# EAGLE board octanis_v0.6 (EAGLE 7.2.0)
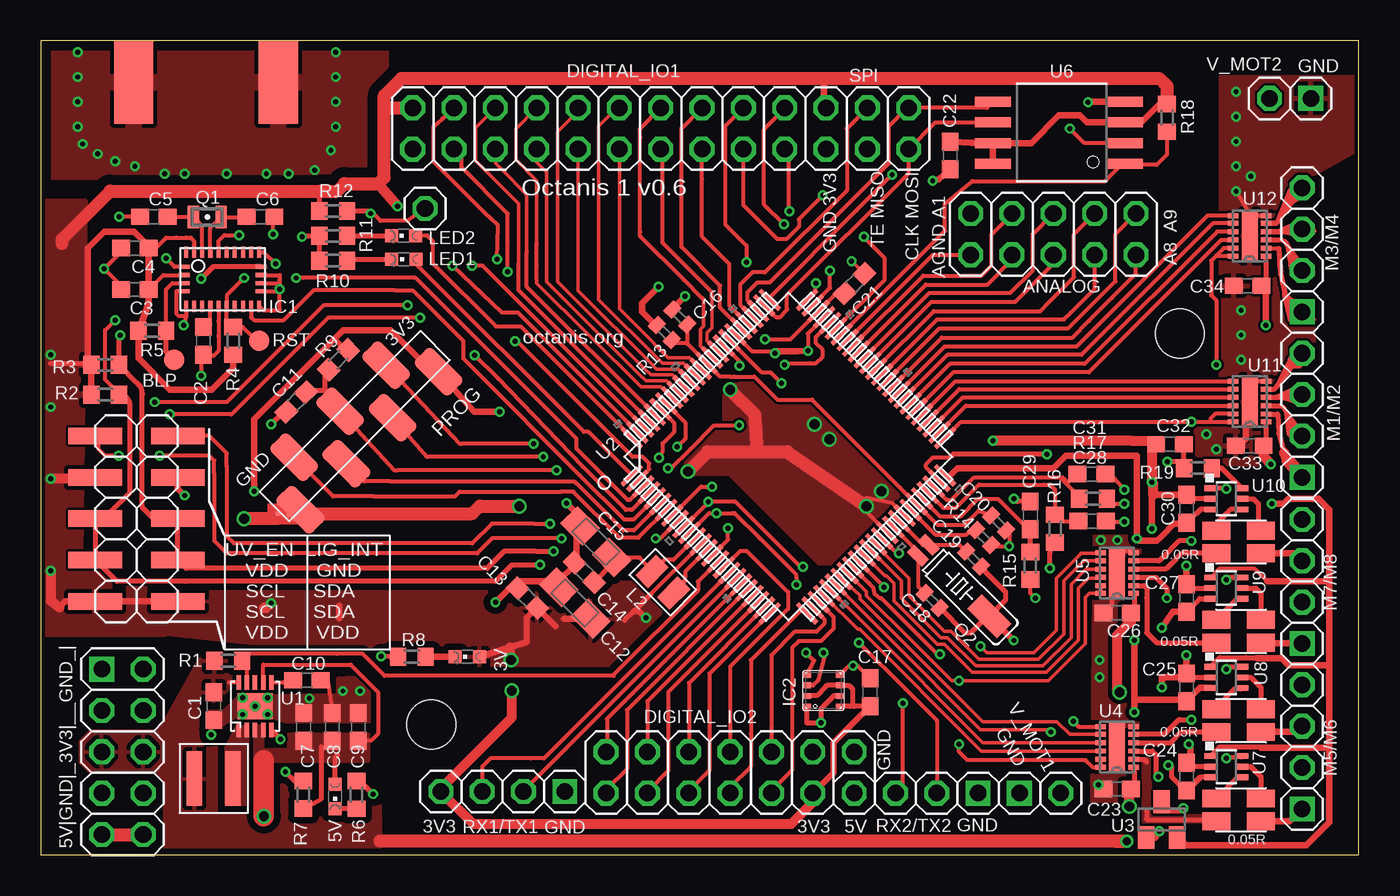
[diagram p2: board, top side]
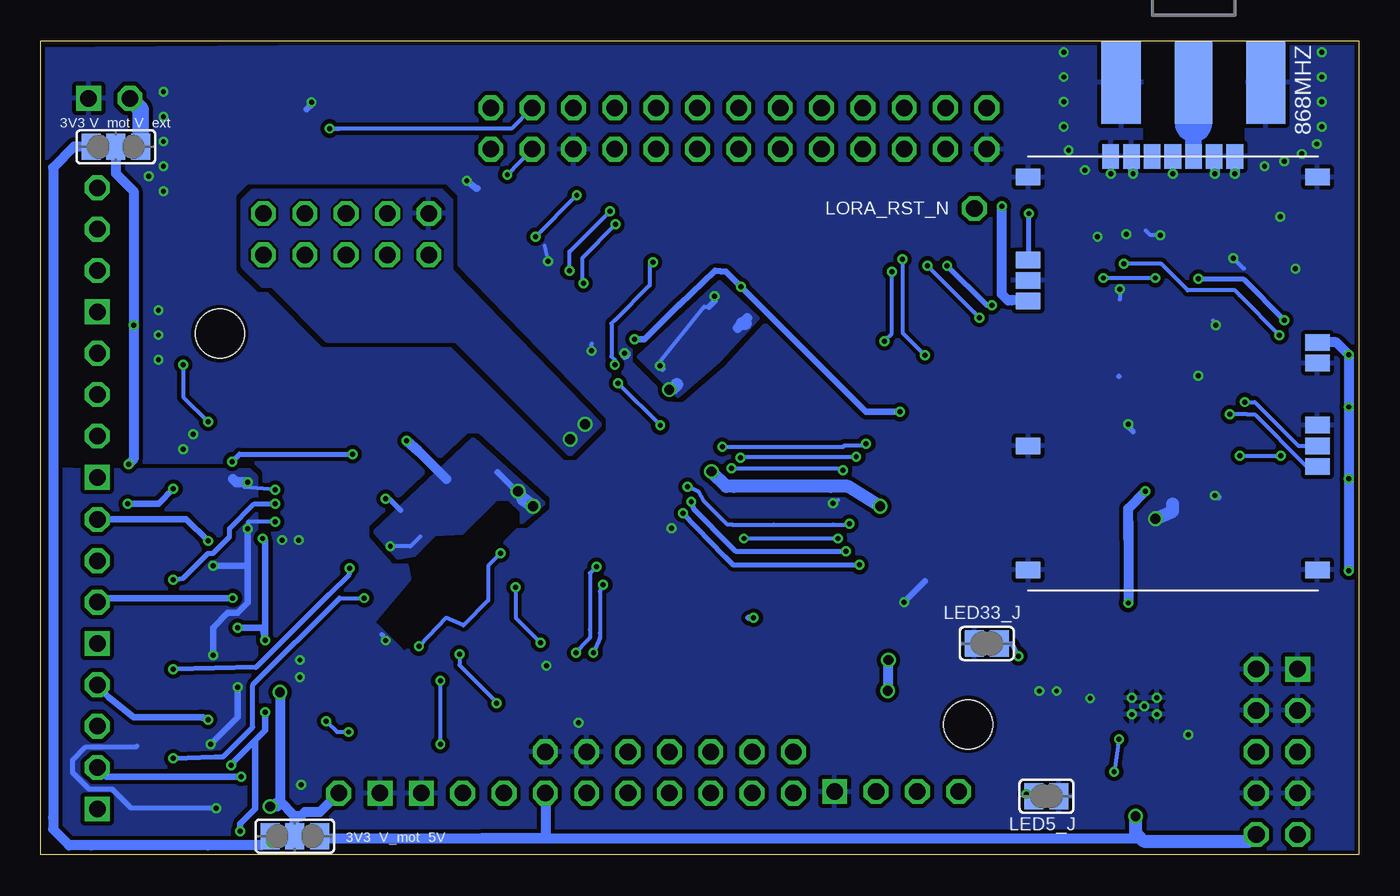
[diagram p3: board, bottom side, seen from below]

Size 81 x 50 mm. Coordinates in mm from the lower left corner, seen from the top.
Outline: 0,0 81,0 81,50 0,50 0,0
Copper layers (1*16): Top 0.035mm / dielectric 1.5mm / Bottom 0.035mm
Design rules "SeeedStudio_2layer_DRU_no_angle_20140221 *": minimum track width 8mil, minimum drill 12mil, track to track 6mil, track to pad 8mil, pad to pad 6mil, via to via 8mil, smd to smd 0mil, copper to edge 10mil, drill to drill 10mil, minimum pad ring 6mil, minimum via ring 6mil, stop-mask expansion 2mil, vias tented up to drill 100mil, thermal gap 10mil
Net classes: 0 default: width 0.203 mm; 1 power: width 0.203 mm, drill 0.305 mm, clearance 0.152 mm; 2 VIN: width 0.203 mm, drill 0.305 mm, clearance 0.152 mm; 3 fine: width 0.406 mm, drill 0.61 mm, clearance 0.152 mm
Holes 3 mm at 70,32 24,8

## Footprints (pad centres in the part's own frame; a part is rotated, then mirrored left to right if it is on the bottom)
CHIPLED_0603 = smd 0.8 x 0.8: A 0,-0.75; C 0,0.75
SMA_EDGELAUNCH = smd 5.08 x 2.413: GND@1 2.54,-4.445; GND@2 2.54,4.445 | smd 5.08 x 2.413 bottom: GND@3 2.54,4.445; GND@4 2.54,-4.445 | smd 5.08 x 2.286: P 2.54,0
2X05 = drill 1.016 octagon: 1 -5.08,-1.27; 2 -5.08,1.27; 3 -2.54,-1.27; 4 -2.54,1.27; 5 0,-1.27; 6 0,1.27; 7 2.54,-1.27; 8 2.54,1.27; 9 5.08,-1.27; 10 5.08,1.27
B1,27 = smd 1.27 x 1.27: TP 0,0
C0603 = smd 1.1 x 1: 1 -0.85,0; 2 0.85,0
A/3216-18R = smd 1.95 x 1.5: + 1.375,0; - -1.375,0
C0402 = smd 0.7 x 0.9: 1 -0.65,0; 2 0.65,0
2X11 = drill 1.016 octagon: 1 -12.7,-1.27; 2 -12.7,1.27; 3 -10.16,-1.27; 4 -10.16,1.27; 5 -7.62,-1.27; 6 -7.62,1.27; 7 -5.08,-1.27; 8 -5.08,1.27; 9 -2.54,-1.27; 10 -2.54,1.27; 11 0,-1.27; 12 0,1.27; 13 2.54,-1.27; 14 2.54,1.27; 15 5.08,-1.27; 16 5.08,1.27; 17 7.62,-1.27; 18 7.62,1.27; 19 10.16,-1.27; 20 10.16,1.27; 21 12.7,-1.27; 22 12.7,1.27
BNO055 = smd 0.675 x 0.25: 1 1.663,2.25; 6 -1.665,2.25; 7 -1.665,1.75; 8 -1.665,1.25; 9 -1.665,0.75; 10 -1.665,0.25; 11 -1.665,-0.25; 12 -1.665,-0.75; 13 -1.665,-1.25; 14 -1.665,-1.75; 15 -1.665,-2.25; 20 1.663,-2.25; 21 1.663,-1.75; 22 1.663,-1.25; 23 1.663,-0.75; 24 1.663,-0.25; 25 1.663,0.25; 26 1.663,0.75; 27 1.663,1.25; 28 1.663,1.75 | smd 0.25 x 0.675: 2 0.75,2.362; 3 0.25,2.362; 4 -0.25,2.362; 5 -0.75,2.362; 16 -0.75,-2.362; 17 -0.25,-2.362; 18 0.25,-2.362; 19 0.75,-2.362
BME280 = smd 0.35 x 0.5: 1 0.975,-1.025; 2 0.325,-1.025; 3 -0.325,-1.025; 4 -0.975,-1.025; 5 -0.975,1.025; 6 -0.325,1.025; 7 0.325,1.025; 8 0.975,1.025
2X05' = drill 1.016 square: 1 -5.08,-1.27 | drill 1.016 octagon: 2 -5.08,1.27; 3 -2.54,-1.27; 4 -2.54,1.27; 5 0,-1.27; 6 0,1.27; 7 2.54,-1.27; 8 2.54,1.27; 9 5.08,-1.27; 10 5.08,1.27
2X05SMD = smd 1.016 x 3.302: 1 -1.27,-3.81; 2 -1.27,1.27; 3 1.27,-3.81; 4 1.27,1.27; 5 3.81,-3.81; 6 3.81,1.27; 7 6.35,-3.81; 8 6.35,1.27; 9 8.89,-3.81; 10 8.89,1.27
2X02 = drill 1.016 octagon: 1 -1.27,-1.27; 2 -1.27,1.27; 3 1.27,-1.27; 4 1.27,1.27
XFL4020 = smd 0.965 x 3.353: P$1 -1.181,0; P$2 1.181,0
0806 = smd 1.1 x 1.8: 1 -0.94,0; 2 0.94,0
SJ = smd 1.168 x 1.6: 1 -0.762,0; 2 0.762,0
1X01 = drill 1.016 octagon: 1 0,0
1X04-S = drill 1.016 square: 1 -3.81,0 | drill 1.016 octagon: 2 -1.27,0; 3 1.27,0; 4 3.81,0
1X7SMD = smd 3.048 x 1.524: 1 -1.27,6; 2 1.27,4; 3 -1.27,2; 4 1.27,0; 5 -1.27,-2; 6 1.27,-4; 7 -1.27,-6
FC-12M = smd 0.7 x 1.4: 1 -0.85,0; 2 0.85,0
MS3V-T1R = smd 0.635 x 1.27: P1 -0.47,-4.43; P2 0.47,-4.43 | smd 1.27 x 2.54: P3 0,1.3
R0603 = smd 1 x 1.1: 1 -0.85,0; 2 0.85,0
R0402 = smd 0.7 x 0.9: 1 -0.65,0; 2 0.65,0
4PADS_RESISTOR = smd 1.727 x 1.1: I1 0,0; I2 2.751,0; V1 0,1.4; V2 2.751,1.4
S-PVSON-N10 = smd 0.28 x 0.825: 1 -1,-1.462; 2 -0.5,-1.462; 3 0,-1.462; 4 0.5,-1.462; 5 1,-1.462; 6 1,1.462; 7 0.5,1.462; 8 0,1.462; 9 -0.5,1.462; 10 -1,1.462 | smd 2.15 x 1.6: EXPAD 0,0 | drill 0.3 pad 0.605: GND1 -0.762,0.508 | drill 0.3 pad 0.61: GND2 -0.762,-0.508; GND3 0,0; GND4 0.762,-0.508 | drill 0.305 pad 0.605: GND5 0.762,0.508
PZ100 = smd 1.676 x 0.279: 1 -7.62,5.994; 2 -7.62,5.512; 3 -7.62,5.004; 4 -7.62,4.496; 5 -7.62,3.988; 6 -7.62,3.505; 7 -7.62,2.997; 8 -7.62,2.489; 9 -7.62,2.007; 10 -7.62,1.499; 11 -7.62,0.991; 12 -7.62,0.508; 13 -7.62,0; 14 -7.62,-0.508; 15 -7.62,-0.991; 16 -7.62,-1.499; 17 -7.62,-2.007; 18 -7.62,-2.489; 19 -7.62,-2.997; 20 -7.62,-3.505; 21 -7.62,-3.988; 22 -7.62,-4.496; 23 -7.62,-5.004; 24 -7.62,-5.512; 25 -7.62,-5.994; 51 7.62,-5.994; 52 7.62,-5.512; 53 7.62,-5.004; 54 7.62,-4.496; 55 7.62,-3.988; 56 7.62,-3.505; 57 7.62,-2.997; 58 7.62,-2.489; 59 7.62,-2.007; 60 7.62,-1.499; 61 7.62,-0.991; 62 7.62,-0.508; 63 7.62,0; 64 7.62,0.508; 65 7.62,0.991; 66 7.62,1.499; 67 7.62,2.007; 68 7.62,2.489; 69 7.62,2.997; 70 7.62,3.505; 71 7.62,3.988; 72 7.62,4.496; 73 7.62,5.004; 74 7.62,5.512; 75 7.62,5.994 | smd 0.279 x 1.676: 26 -5.994,-7.62; 27 -5.512,-7.62; 28 -5.004,-7.62; 29 -4.496,-7.62; 30 -3.988,-7.62; 31 -3.505,-7.62; 32 -2.997,-7.62; 33 -2.489,-7.62; 34 -2.007,-7.62; 35 -1.499,-7.62; 36 -0.991,-7.62; 37 -0.508,-7.62; 38 0,-7.62; 39 0.508,-7.62; 40 0.991,-7.62; 41 1.499,-7.62; 42 2.007,-7.62; 43 2.489,-7.62; 44 2.997,-7.62; 45 3.505,-7.62; 46 3.988,-7.62; 47 4.496,-7.62; 48 5.004,-7.62; 49 5.512,-7.62; 50 5.994,-7.62; 76 5.994,7.62; 77 5.512,7.62; 78 5.004,7.62; 79 4.496,7.62; 80 3.988,7.62; 81 3.505,7.62; 82 2.997,7.62; 83 2.489,7.62; 84 2.007,7.62; 85 1.499,7.62; 86 0.991,7.62; 87 0.508,7.62; 88 0,7.62; 89 -0.508,7.62; 90 -0.991,7.62; 91 -1.499,7.62; 92 -2.007,7.62; 93 -2.489,7.62; 94 -2.997,7.62; 95 -3.505,7.62; 96 -3.988,7.62; 97 -4.496,7.62; 98 -5.004,7.62; 99 -5.512,7.62; 100 -5.994,7.62
MAX6001 = smd 1 x 1.4: 1 -0.95,-1.1; 2 0.95,-1.1; 3 0,1.1
SON50P200X300X80-13N = smd 0.66 x 0.305: 1 -1.016,1.245; 2 -1.016,0.762; 3 -1.016,0.254; 4 -1.016,-0.254; 5 -1.016,-0.762; 6 -1.016,-1.245; 7 1.016,-1.245; 8 1.016,-0.762; 9 1.016,-0.254; 10 1.016,0.254; 11 1.016,0.762; 12 1.016,1.245 | smd 0.991 x 3.099: 13 0,0
SOIC_8-LEAD = smd 0.61 x 2.21: CE -1.905,-2.934; RST/HOLD -0.635,5.156; SCK 0.635,5.156; SI 1.905,5.156; SO -0.635,-2.934; VDD -1.905,5.156; VSS 1.905,-2.934; WP 0.635,-2.934
SC70-6 = smd 0.35 x 0.8: 1 -0.65,-0.95; 2 0,-0.95; 3 0.65,-0.95; 4 0.65,0.95; 5 0,0.95; 6 -0.65,0.95
RN2483 = smd 1.524 x 1.016: P$1 17.78,1.27; P$6 17.78,7.62; P$7 17.78,8.89; P$8 17.78,10.16; P$11 17.78,13.97; P$12 17.78,15.24; P$20 17.78,25.4; P$28 0,25.4; P$32 0,20.32; P$33 0,19.05; P$34 0,17.78; P$41 0,8.89; P$47 0,1.27 | smd 1.016 x 1.524: P$21 12.7,26.67; P$22 11.43,26.67; P$23 10.16,26.67; P$24 8.89,26.67; P$25 7.62,26.67; P$26 6.35,26.67; P$27 5.08,26.67
STAR = smd 0.152 x 0.305: AGND 0.635,-0.635; DGND 0.635,0.635 | smd 0.305 x 0.152: GND 0.635,0
1X02-S = drill 1.016 square: 1 -1.27,0 | drill 1.016 octagon: 2 1.27,0
SJ_2 = smd 1.168 x 1.6: 1 -1.524,0; 2 0,0; 3 1.524,0

## Placement (x,y rotation side)
3V  3V-ok  [CHIPLED_0603]  26.21,12.16 90 top
5V  5V-ok  [CHIPLED_0603]  18.08,3.57 180 top
868MHZ  [SMA_EDGELAUNCH]  10.16,49.98 270 bottom
ANALOG  [2X05]  62.23,38.12 0 top
BLP  PTR1B1,27  [B1,27]  8.21,30.4 180 top
C1  22uF  [C0603]  10.64,9.12 270 top
C2  100n  [C0603]  10.01,31.56 90 top
C3  100n  [C0603]  5.79,34.72 180 top
C4  120n  [C0603]  5.79,37.26 180 top
C5  12p  [C0603]  6.96,39.18 180 top
C6  12p  [C0603]  13.51,39.18 0 top
C7  22uF  [C0603]  16.17,7.85 90 top
C8  22uF  [C0603]  17.93,7.85 90 top
C9  3 x 22uF  [C0603]  19.53,7.85 90 top
C10  10nF  [C0603]  16.35,10.71 0 top
C11  1n  [C0603]  15.7,27.8 45 top
C12  10u  [A/3216-18R]  32.82,15.46 315 top
C13  100n  [C0603]  29.9,15.77 315 top
C14  100n  [C0603]  33.4,17.34 315 top
C15  10u  [A/3216-18R]  34.11,19.22 315 top
C16  100n  [C0402]  39.28,33.03 135 top
C17  100n  [C0603]  50.97,9.98 90 top
C18  12p  [C0402]  54.79,15.62 135 top
C19  12p  [C0402]  57.33,18.16 135 top
C20  100n  [C0402]  58.86,20.37 315 top
C21  100n  [C0603]  50.01,35.09 225 top
C22  100n  [C0603]  55.88,42.95 270 top
C23  470n  [C0603]  66.14,4.03 0 top
C24  10n  [C0603]  70.41,4.79 270 top
C25  10n  [C0603]  70.41,10.28 270 top
C26  470n  [C0603]  66.14,14.85 0 top
C27  10n  [C0603]  70.41,15.76 270 top
C28  470n  [C0603]  64.62,20.49 180 top
C29  470n  [C0603]  60.81,20.84 270 top
C30  10n  [C0603]  70.41,21.25 270 top
C31  470n  [C0603]  64.57,23.38 180 top
C32  470n  [C0603]  69.39,25.21 0 top
C33  470n  [C0603]  74.3,25.12 0 top
C34  470n  [C0603]  74.16,34.94 0 top
DIGITAL_IO1  [2X11]  35.56,44.61 180 top
DIGITAL_IO2  [2X05]  39.83,5.05 0 top
IC1  BNO055A  [BNO055]  11.18,35.36 90 top
IC2  BME280  [BME280]  48.1,10.08 270 top
JP1  [2X05']  5.03,6.32 270 top
JP2  [2X05SMD]  7.16,24.45 270 top
JP3  [2X02]  48.72,5.05 0 top
L1  1uH  [XFL4020]  10.64,4.67 0 top
L2  4.7uH  [0806]  38.23,16.73 315 top
LED1  LED1  [CHIPLED_0603]  22.33,36.57 90 top
LED2  LED0  [CHIPLED_0603]  22.3,38.02 90 top
LED5_J  [SJ]  19.19,3.59 180 bottom
LED33_J  [SJ]  22.86,12.97 0 bottom
LORA_RST_N  [1X01]  23.62,39.69 0 top
M1/M2  [1X04-S]  77.52,26.99 90 top
M3/M4  [1X04-S]  77.52,37.15 90 top
M5/M6  [1X04-S]  77.52,6.62 90 top
M7/M8  [1X04-S]  77.52,16.78 90 top
PROG  [1X7SMD]  19.3,26.33 135 top
Q1  32.768kHz  [FC-12M]  10.24,39.17 180 top
Q2  32.768kHz  [MS3V-T1R]  57.38,15.57 225 top
R1  1M  [R0603]  11.53,11.91 180 top
R2  4.7k  [R0603]  3.96,28.26 180 top
R3  4.7k  [R0603]  3.96,30.09 180 top
R4  100k  [R0603]  11.84,31.56 90 top
R5  100k  [R0603]  6.86,32.18 180 top
R6  1k  [R0603]  19.41,3.67 270 top
R7  1M  [R0603]  16.14,3.68 270 top
R8  1k  [R0603]  22.81,12.16 0 top
R9  47k  [R0603]  18.29,30.39 225 top
R10  1k  [R0603]  17.98,36.49 0 top
R11  1k  [R0603]  17.98,38.01 0 top
R12  100k  [R0603]  17.98,39.54 180 top
R13  0R  [R0402]  38.33,32.08 135 top
R14  91k 0.1% ±25 ppm/°C  [R0402]  57.94,19.48 315 top
R15  6.8k  [R0603]  60.81,17.75 270 top
R16  6.8k  [R0603]  62.33,20.03 270 top
R17  6.8k  [R0603]  64.67,21.86 0 top
R18  10k  [R0603]  69.21,45.26 90 top
R19  6.8k  [R0603]  71.12,23.74 0 top
RS1  0.05R  [4PADS_RESISTOR]  72.24,2.05 0 top
RS2  0.05R  [4PADS_RESISTOR]  72.24,7.53 0 top
RS3  0.05R  [4PADS_RESISTOR]  72.24,13.02 0 top
RS4  0.05R  [4PADS_RESISTOR]  72.24,18.51 0 top
RST  PTR1B1,27  [B1,27]  13.41,31.57 180 top
RX1/TX1  [1X04-S]  28.4,3.88 180 top
RX2/TX2  [1X04-S]  53.8,3.78 180 top
SPI  [2X02]  52.07,44.61 0 top
U1  TPS61232  [S-PVSON-N10]  13.18,9.12 0 top
U2  MSP432  [PZ100]  45.95,24.45 45 top
U3  MAX6001SOT-23  [MAX6001]  68.88,2.15 0 top
U4  DRV8836DSSR  [SON50P200X300X80-13N]  66.14,6.62 180 top
U5  DRV8836DSSR  [SON50P200X300X80-13N]  66.14,17.29 180 top
U6  SST25VF064C  [SOIC_8-LEAD]  63.68,44.35 90 top
U7  INA210  [SC70-6]  72.85,5.4 270 top
U8  INA210  [SC70-6]  72.85,10.89 270 top
U9  INA210  [SC70-6]  72.85,16.37 270 top
U10  INA210  [SC70-6]  72.85,21.86 270 top
U11  DRV8836DSSR  [SON50P200X300X80-13N]  74.29,27.83 180 top
U12  DRV8836DSSR  [SON50P200X300X80-13N]  74.29,38.02 180 top
U100  RN2483  [RN2483]  20.32,16.22 0 bottom
U$1  WEATHER_STRIP_DOCU  [WEATHER_STRIP_DOCU]  16.38,17.06 0 top
U$2  STARGND  [STAR]  15.21,21.55 270 top
V_MOT1  [1X02-S]  61.42,3.78 0 top
V_MOT2  [1X02-S]  76.78,46.46 180 top
VMOT_SEL  3V3 V_Motor 5V  [SJ_2]  76.38,43.48 0 bottom
VMOT_SEL100  3V3 V_Motor 5V  [SJ_2]  65.38,1.13 0 bottom

## Tracks (layer width: path | path; a pad name or v marks a point on that pad's centre or on a via)
3V3_MODULE2  (via drill 0.5)
  Top 0.254: U1.10 12.18,10.89 | U1.10 | U1.10 11.58,10.58
  Top 0.813: 65.99,0.83 v66.75,0.83 65.99,0.83 | 65.99,0.83 20.83,0.83
  Bottom 0.61: v66.75,0.83 VMOT_SEL100.1 67.46,0.57 70.71,0.57 77.88,0.57 79.25,0.57 80.24,1.56 80.24,2.28 80.24,42.2 78.94,43.5 78.33,43.5 78.31,43.48 VMOT_SEL.1
  pour Top (isolate 0.406, rank 3): 7.92,-0.09 20.88,-0.14 20.83,9.92 20.73,9.97 10.97,12.26 10.06,12.46 7.62,8.14 7.01,7.53 3.05,7.53 2.44,6.92 2.44,5.71 3.05,5.1 7.01,5.1 7.62,4.49 7.62,0.22
5VEN
  Top 0.254: U1.9 12.68,12.29 R1.1 12.76,12.34 18.16,12.34 19.78,12.34 21.13,10.99 35.2,10.99 35.2,11.04 40.39,16.22 40.39,16.77 U2.16
+3V3  (via drill 0.3, 0.6)
  Top 0.254: U2.13 37.52,16.02 | 47.76,33.38 U2.73 | v44.5,31.65 46.07,31.65 U2.73 | C21.2 49.08,34.66 U2.73 | 9.43,37.44 IC1.28 9.43,37.69 9.22,37.9 8.97,37.9 8.34,37.9 7.7,37.9 7.07,37.26 C4.1 | C3.1 7.53,35.61 IC1.3 | R4.1 12.21,30.34 | C17.1 50.94,9.1 | 17.13,40.85 17.22,40.93 17.22,40.76 | 17.07,30.62 16.99,30.62
  Top 0.305: IC2.2 47.09,9.77 47.69,9.77 48.23,10.32 48.32,10.4 IC2.6 49.66,10.4 49.89,10.18 49.89,9.21 49.99,9.1 | 37.52,16.02 37.45,15.95 36.46,14.96 35.88,14.39 | 11.73,30.61 R4.1 | 50.94,9.1 49.99,9.1 | 49.99,9.1 49.78,9.1 IC2.8 | R12.2 17.13,40.85 | R9.1 18.75,31 18.06,31.69 | 2.9,30.31 2.75,30.17 0.61,30.17
  Top 0.406: 18.34,14.53 18.34,15.29 | R13.2 37.77,32.53 36.96,33.35 36.96,33.88 v37.97,34.89 | U6.RST/HOLD 60.12,43.71 60.87,43.71 62.56,45.41 63.87,45.41 64.29,44.98 U6.WP 66.66,45.02 67.67,45.02 68.75,46.11 R18.2 | U6.RST/HOLD U6.VDD | C22.1 55.99,43.8 57.15,43.74 58.5,43.74 U6.RST/HOLD | DIGITAL_IO1.1 48.13,46 48.13,47.32 48.13,47.49 47.93,47.69 | C12.+ 32.17,14.49 | 31.64,14.03 C13.2 29.87,14.54 29.87,13.06 28.84,12.74 3V.A | v37.19,14.54 36.77,14.96 36.46,14.96 | 3.05,27.96 3.05,28.26 R2.2 R3.2 2.9,30.31 2.9,37.25 3.2,37.56 3.91,38.27 5.74,38.27 5.89,38.12 6.64,37.36 C4.1 C3.1 6.64,33.88 R5.2 6.01,30.48 7.92,28.57 10.52,28.57 11.53,29.58 11.84,29.89 R4.1 | v28.19,27.19 26.62,27.19 PROG.7 | 23.43,30.29 21.49,32.22 18.59,32.22 18.06,31.69 16.99,30.62 13.11,26.74 13.11,23.69 v13.11,22.32 | JP3.1 48.72,5.04 48.72,6.88 C17.1 | JP2.10 1.52,15.56 1.14,15.18
  Top 0.61: v14.17,15.46 13.87,15.15 13.72,15.15 | v0.61,17.44 0.61,15.61 1.14,15.18 | PROG.7 23.43,30.29 | 2.23,23.08 v0.61,23.08 | v21.95,39.84 20.73,41.22 | JP3.1 47.45,3.22 46.13,1.9 26.57,1.9 RX1/TX1.4 24.69,3.98 24.69,4.18 28.96,8.45 v28.96,10.07 | v28.91,11.95 28.84,12.02 28.84,12.74
  Top 0.813: 1.29,37.56 1.29,37.79 4.27,40.76 17.22,40.76 18.21,40.76 18.67,41.22 20.73,41.22 21.11,41.6 21.11,45.86 | 21.11,45.86 21.11,46.62 22.17,47.69 47.7,47.69 47.93,47.69 68.73,47.69 69.04,47.39 69.21,47.22 R18.2 | DIGITAL_IO1.21 22.85,45.86 21.11,45.86
  Bottom 0.305: U100.P$12 2.46,31.38 1.37,31.38
  Bottom 0.406: v44.5,31.65 43.89,31.65 41.77,33.78 41.73,33.78 39.55,35.86 38.89,35.81 v37.97,34.89 30.27,27.19 v28.19,27.19 | 37.49,14.54 v37.19,14.54 | v0.61,23.08 0.61,23.54
  Bottom 0.61: 14.17,20.49 14.17,19.42 | 14.17,19.42 v14.17,15.46 | v0.61,17.44 v0.61,23.08 0.61,23.54 v0.61,27.5 0.61,27.8 v0.61,30.7 1.37,31.46 U100.P$12 | 14.17,19.42 14.17,21.25 v13.11,22.32 | v21.95,39.84 21.95,37.41 21.95,34.43 21.57,34.05 21.34,34.05 20.37,34.05 U100.P$34 | v28.96,10.07 28.91,10.12 v28.91,11.95
  pour Top: 0.36,13.58 7.62,13.58 7.62,17.69 2.44,18.35 2.69,40.1 0.36,40.1
  pour Top (isolate 0.406, rank 2): 7.62,16.73 38.66,16.73 37.8,10.33 7.67,13.53
+5V  (via drill 0.6)
  Top 0.254: U1.7 13.68,11.67 19.05,11.67 20.73,9.99 20.73,7.43 20.29,7 C9.1
  Top 0.305: R7.2 17.25,3.44 17.25,6.64 | 5V.A 18.09,5.97 18.24,6.12
  Top 0.813: JP1.9 JP1.10
  Top 1.27: v13.72,2.35 13.72,5.81
  Bottom 0.61: 53.95,1 63.59,1 63.72,1 VMOT_SEL100.3 | 53.95,1 49.99,1 | 49.99,1 13.41,1 | 49.99,1 JP3.3 49.99,1 | 49.99,1 53.95,1 | 6.71,0.83 JP1.10
  Bottom 0.813: v13.72,2.35 13.72,1.31 13.41,1 13.24,0.83 6.71,0.83
  pour Top (no thermals): 20.16,7.37 15.24,7.37 15.24,6.42 13.65,6.42 13.65,7.85 13.18,7.85 13.18,5.78 20.16,5.78
A1
  Top 0.254: U2.68 54.82,36.85 ANALOG.1
A2
  Top 0.254: U2.67 54.23,35.58 57.15,35.58 57.81,35.58 58.42,36.19 58.42,38.06 59.69,39.34 ANALOG.4
A3
  Top 0.254: U2.66 54.39,35.02 58.17,35.02 59.69,36.54 ANALOG.3
A4
  Top 0.254: U2.65 54.6,34.51 59.59,34.51 60.96,35.88 60.96,38.12 ANALOG.6
A5
  Top 0.254: U2.64 54.73,33.95 59.89,33.95 60.76,34.81 62.23,36.29 ANALOG.5
A6
  Top 0.254: U2.63 54.89,33.39 61.42,33.39 62.03,34 63.5,35.47 63.5,38.12 ANALOG.8
A7
  Top 0.254: U2.62 55.1,32.88 62.89,32.88 63.3,33.29 64.77,34.76 ANALOG.7
A8
  Top 0.254: U2.61 55.22,32.33 63.14,32.33 64.62,33.8 66.04,35.22 66.04,38.12 ANALOG.10
A9
  Top 0.254: U2.60 55.38,31.77 63.4,31.77 64.41,32.78 65.84,34.2 67.31,35.68 ANALOG.9
A20  (via drill 0.3)
  Top 0.254: U2.49 54.56,23.64 54.41,23.79 54.41,23.99 54.81,24.4 54.91,24.4 55.88,24.4 55.93,24.45
  Top 0.305: 70.24,23.77 R19.1 70.24,23.77 | 70.24,23.77 69.86,24.15 v69.24,24.15 | 70.24,23.77 C32.2 | v61.82,24.6 56.08,24.6 55.93,24.45
  Bottom 0.305: v69.24,24.15 68.78,24.6 v61.82,24.6
A20UNF
  Top 0.305: U10.6 72.57,23.74 R19.2
A21
  Top 0.254: U2.48 55.67,21.81 56.08,21.81 56.08,21.91 57.35,23.18 62.64,23.18 | C31.2 63.14,22.88 62.79,23.18 62.64,23.18 | R17.1 63.82,22 62.64,23.18
A21UNF  (via drill 0.3)
  Top 0.254: R17.2 65.52,21.55 v66.6,21.55
  Top 0.305: U9.6 72.89,17.02 v72.85,16.88
  Bottom 0.305: v72.85,16.88 72.24,16.98 70.71,18.51 70.41,18.51 69.39,19.52 69.39,20.03 67.87,21.55 66.9,21.55 v66.6,21.55
A22
  Top 0.254: C28.2 62.72,20.49 R16.1 62.33,22.42 62.03,22.72 61.67,22.72 57.66,22.72 56.24,21.3 55.46,21.3 U2.47
A22UNF  (via drill 0.3)
  Top 0.305: v72.85,11.39 72.89,11.54 U8.6 | v62.03,17.59 62.03,18.57 R16.2
  Bottom 0.305: v72.85,11.39 67.77,11.5 67.36,11.9 63.3,15.97 62.03,17.24 v62.03,17.59
A23
  Top 0.254: U2.46 55.25,20.79 56.54,20.79 57.61,21.86 58.83,21.86 60.44,20.25 C29.2
  Top 0.305: R15.1 C29.2 60.44,20.25
A23UNF  (via drill 0.3)
  Top 0.254: U7.6 73.76,6.01 | v61.11,15.76 60.81,16.07 R15.2
  Top 0.305: 73.76,6.01 v72.85,5.91
  Bottom 0.254: 62.64,15.76 v61.11,15.76
  Bottom 0.305: 70.31,6.01 v72.85,5.91 70.31,6.01 | 70.31,6.01 69.8,6.01 67.97,7.84 67.97,10.43 62.64,15.76
ACCEL_INT
  Top 0.254: U2.5 36.43,20.58 35.87,20.58 33.12,23.32 26.62,29.82 25.96,30.48 25.96,31.56 22.86,34.66 21.78,34.66 16.76,34.66 16.15,34.05 14.94,32.83 13.11,32.83 12.93,33.01 IC1.14
ACCEL_N_BOOTLD
  Top 0.254: R5.1 7.7,33.24 7.7,34.72 8.09,35.11 IC1.4
  Top 0.305: BLP.TP 7.71,30.9 R5.1
ACCEL_N_RST  (via drill 0.3)
  Top 0.254: U2.3 36.22,21.8 36.07,21.8 33.43,24.44 32.92,24.95 32.92,25.55 27.43,31.04 27.13,31.35 23.05,35.42 16.15,35.42 v15.7,35.42 | v12.5,35.42 11.43,34.36 IC1.11 11.43,32.45 R4.2 12.42,32.41 12.96,31.88 RST.TP
  Bottom 0.254: v15.7,35.42 v12.5,35.42
AGND  (via drill 0.3, 0.6)
  Top 0.203: C20.2 59.17,20.1 59.31,19.96
  Top 0.254: U2.40 50.71,21.09 | U2.43 52.33,21.6 50.71,21.91 | R14.2 58.47,18.94 v59.51,18.94 59.51,19.76 59.31,19.96 | U2.84 43.09,30.15 v42.94,30.04 | C28.1 65.67,20.44 v66.6,20.44 | C31.1 65.73,23.38 v66.6,22.42 | C32.1 68.33,25.21 68.28,25.26
  Top 0.305: C20.2 59.21,20.06 | 70.65,5.4 C24.1 arc90 70.65,5.4 | U7.2 70.65,5.4 | U10.2 70.65,21.86 C30.1 | C27.1 70.65,16.37 U9.2 | C25.1 70.65,10.89 U8.2 | U3.3 68.9,3.25 69.44,2.71 70.05,2.71 v70.21,2.86 | C29.1 60.01,21.69 v59.79,21.86
  Top 0.406: C16.2 38.82,33.52 v39.6,34.3 | 70.65,5.4 70.65,6.68 v70.56,6.77 | 68.89,10.89 69.95,10.89 | 69.95,10.89 70.17,10.89 C25.1 v70.41,12.26 | v68.89,10.28 68.89,10.89 | 68.89,10.89 69.95,10.89 | C27.1 v70.41,17.75 | v68.28,20.03 68.28,22.01 68.36,22.1 C30.1
  Top 0.61: v68.28,22.88 68.28,22.98 | v58.52,25.42 67.06,25.42 68.28,25.42 68.28,25.26 v68.28,22.88 | 68.36,22.1 68.36,22.79 v68.28,22.88
  Top 0.813: v39.78,23.54 41,24.76 44.04,24.76 | 44.04,24.76 43.89,27.04 v42.37,28.57 | 44.04,24.76 45.87,24.76 v50.75,21.4 | U$2.AGND 15.8,21.61 15.8,21.45 16.31,20.95 26.52,20.95 26.98,21.4 v29.41,21.4
  Bottom 0.254: 43.1,30.08 40.23,33.66 39.92,33.66 | 57.66,19.55 58.27,18.94 v59.51,18.94 | v66.6,20.44 68.28,20.44 v68.28,20.03 | v66.6,22.42 68.48,22.57 68.78,22.88
  Bottom 0.305: v70.21,2.86 75.44,2.86 76.61,4.03 78.03,4.03 79.05,5.04 79.05,5.81 78.23,6.62 75.13,6.62 75.08,6.67 | v59.79,21.86 59.59,21.86 58.88,21.15
  Bottom 0.406: 51.35,21.91 52.62,23.18 52.92,23.5 | v42.94,30.04 42.77,29.85 | v39.6,34.3 39.6,33.98 39.92,33.66 | v70.56,6.77 68.89,8.45 v68.89,10.28 | v70.41,17.75 69.65,17.75 68.28,17.75 | 68.28,17.75 68.28,15.46 68.89,14.85 69.49,14.85 70.41,13.94 v70.41,12.26 | 68.28,17.75 v68.28,20.03
  Bottom 0.61: 37.57,32.96 37.9,32.63 38.18,32.35 | v58.52,25.42 57.81,24.81 56.08,23.08 | v68.28,22.88 68.78,22.88 68.99,22.88 69.19,23.08
  Bottom 0.813: 37.7,32.63 37.9,32.63 | v29.41,21.4 31.39,22.62 32.46,22.62 38.41,22.62 38.86,22.62 v39.78,23.54 | v42.37,28.57 42.06,28.72 41.91,28.87 | v50.75,21.4 51.38,21.86
  other vias: 47.55,26.43 48.46,25.52 51.66,22.32
  pour Bottom: 54.43,25.55 60.47,19.83 59.08,18.24 52.62,19.38 50.08,21.6
  pour Bottom: 39.28,35.24 44.3,30.58 41.85,28.13 39.31,30.32 36.88,32.94
  pour Bottom (isolate 0.254, no thermals): 68.17,23.59 78.13,23.59 79.91,23.64 79.65,-0.09 67.77,-0.19 67.77,23.18
  pour Bottom: 56.39,40.76 67.97,40.76 68.58,40.15 68.58,36.19 67.36,34.97 66.75,34.97 63.4,31.61 55.47,31.61 48.46,24.6 46.63,26.43 55.78,35.88 55.78,40.15
  pour Top: 39.62,23.99 42.06,26.43 42.06,28.26 42.67,28.87 42.98,28.87 43.28,29.18 45.11,30.09 53.34,22.47 51.82,21.25 48.46,17.9 47.85,17.9 42.37,23.38 40.23,23.38
ANT868
  Bottom 1.016: U100.P$23 10.16,44.26 | 10.16,44.26 10.16,44.31 10.16,45.69 868MHZ.P | 10.79,44.92 arc-90 10.16,44.26 | 10.16,44.26 arc-90 9.53,44.95
AVCC
  Top 0.254: 39.74,31.44 39.74,31.38 U2.87 41.76,29.36 42.06,29.36 42.37,29.36 42.63,29.36 43.85,29.36 44.04,29.18 45.26,27.96 47.41,27.96 52.81,22.55 U2.45 55.09,20.27 56.78,20.27 57.64,21.14 C20.1 | 39.74,31.44 C16.1 | R13.1 38.97,31.44 39.74,31.44
CURR_SENSE_EN  (via drill 0.3)
  Top 0.254: U2.50 55.75,23.13 arc90 55.83,23.13
  Top 0.305: U7.3 71.22,4.75 | 71.22,4.75 C24.2 | 71.22,4.75 71.22,4.69 | 71.22,4.69 70.41,3.88 | 71.22,4.75 71.22,4.69 | 71.22,4.69 70.41,3.88 | U10.3 71.28,21.21 71.02,20.95 70.95,20.95 C30.2 | C27.2 71.22,15.72 U9.3 | 55.83,23.13 55.88,23.28 | 70.41,3.88 69.49,4.79 69.49,5.4 v69.29,5.5
  Top 0.406: 67.21,9.36 67.36,9.52 70.02,9.52 70.17,9.67 C25.2 71.22,10.24 U8.3 | 67.21,9.36 v67.21,8.75 | C27.2 69.56,14.91 v68.89,13.94 | v67.21,13.17 67.21,9.36 | C30.2 70.34,20.34 69.65,20.34 68.89,19.57 68.58,19.27 68.12,19.27 67.51,19.27 v67.36,19.42 67.36,22.47 67.36,24.5 66.4,24.5 62.99,24.5 62.23,23.74 56.34,23.74 55.88,23.28 | U3.1 68.5,1.05 v68.73,1.44
  Bottom 0.406: 67.21,7.99 67.21,7.64 67.72,7.13 | 67.21,7.99 v67.21,8.75 67.21,7.99 | v68.89,13.94 67.36,13.94 v67.21,13.17 67.21,19.27 v67.36,19.42 | v69.29,5.5 69.34,5.5 67.72,7.13 | v68.73,1.44 68.73,1.9 67.82,2.81 67.82,7.03 67.72,7.13
EXT_LIGHTNING_INT  (via drill 0.3)
  Top 0.254: U2.8 39.62,21.65 40.58,22.61 v41.25,22.61 | v31.29,20.34 30.28,20.34 30.07,20.34 27.74,20.34 26.52,19.12 11.89,19.12 11.43,19.57 11.43,23.84 11.43,24.65 10.36,25.72 9.04,25.72
  Top 0.305: 9.55,25.72 9.04,25.72 JP2.2
  Bottom 0.254: v31.29,20.34 arc90 31.36,20.27 32.31,20.27 35.97,20.27 38.51,20.27 38.8,20.27 38.86,20.34 40.26,21.74 40.57,22.29 41.19,22.61 v41.25,22.61
EXT_UV_EN  (via drill 0.3)
  Top 0.254: U2.9 38.08,19.42 v37.8,19.42 | v32,19.42 27.74,19.42 26.82,18.51 15.54,18.51 11.43,18.51 10.67,19.27 10.67,23.38 10.67,24.2 10.36,24.5 v7.32,24.5 | v4.8,24.5 3.96,24.5 3.56,24.91 3.56,25.52 JP2.1
  Bottom 0.254: v37.8,19.42 v32,19.42 | v7.32,24.5 5.18,24.5 v4.8,24.5
GND  (via drill 0.3, 0.6)
  Top 0.203: 74.34,29.05 74.34,27.83 U11.13 | C21.1 50.47,35.86 v49.84,36.45
  Top 0.254: v73.46,40.76 74.27,39.41 arc90 74.42,39.26 U12.6 | U11.6 74.37,29.07 arc90 74.34,29.05 | C10.2 17.62,10.71 C8.2 | v10.48,7.37 10.48,8.33 | U2.82 43.71,30.93 45.15,30.93 v45.11,30.79 | 32.95,20.46 C15.- 32.75,19.8 32.93,20.11 | U2.15 42.24,19.35 v42.24,20.06 | 32.3,20.2 32.64,20.2 arc90 33.12,20.68 33.12,20.78 | C5.2 v4.83,39.18 | C4.2 4.95,37.05 v3.89,35.99 4.95,34.94 C3.2 | v9.86,29.43 9.86,30.65 C2.1 9.74,30.63 10.62,30.63 10.93,30.94 arc-1 IC1.10 | IC1.15 13.67,33.45 14.69,33.45 v14.69,34.72 | IC1.18 14.69,35.61 14.69,35.36 | 14.69,35.36 v14.69,34.72 | IC1.16 14.69,34.61 v14.69,34.72 | IC1.17 14.69,35.11 14.69,35.36 | IC1.6 8.93,33.41 8.94,33.09 | 8.94,33.09 v8.79,32.51 | 7.82,36.74 v7.7,36.63 8.22,36.11 IC1.2 | IC1.25 10.93,37.7 11.28,38.05 v12.2,38.05 | 48.18,33.02 U2.72 47.3,32.16 47.14,32.01 v47.14,30.94 | IC1.5 8.33,34.61 8.33,33.24 8.48,33.09 8.94,33.09 | v14.28,38.12 14.28,39.03 C6.2 | IC2.5 49.67,11.6 v49.92,11.6 50.19,11.6 C17.2 | C12.- 31.84,16.53 31.7,16.68
  Top 0.305: IC2.1 47.07,8.1 v47.94,8.1 47.94,8.96 48.74,9.75 IC2.7 | 58.3,14.78 Q2.P3 | C15.- 32.3,20.2 | C26.1 65.34,14.81 65.84,15.31 65.84,16.98 U5.13 66.14,18.66 67.03,18.66 U5.6 | v16.05,37.95 16.09,37.99 17.01,37.99 17.11,37.99 R11.1 R10.1 17.01,36.37 | C11.1 14.94,27.2 v14.17,26.43 | C18.1 56.77,13.63 57.15,13.63 58.16,14.65 Q2.P3 | C19.1 57.79,17.64 59.28,16.14 59.28,15.63 Q2.P3
  Top 0.406: v47.14,30.94 46.52,30.93 45.17,30.93 v45.11,30.79 | U6.VSS 64.39,46.25 v64.36,46.23 | C22.2 55.21,41.49 v54.81,41.41 | 32.93,20.11 32.93,18.07 C14.1 32.8,17.78 31.8,16.78 31.75,16.78 | 33.12,20.78 v32.31,21.59 | C12.- 31.44,16.43 31.38,16.37 | 29.66,16.37 C13.1 28.8,16.37 v27.94,15.51 | 31.75,16.78 29.21,16.78 | 31.7,16.68 31.75,16.73 31.75,16.78 | U11.13 74.07,27.61 74.07,25.52 73.66,25.11 C33.1 | JP2.4 8.43,22.47 v8.84,22.06 | v59.79,13.15 | v59.79,13.15 Q2.P3
  Top 0.813: U$2.GND U$2.DGND U$2.GND | PROG.1 14.91,21.66 U$2.GND | U$2.GND 14.57,20.64 v12.5,20.64
  Bottom 0.203: v49.84,36.45 50.04,37.44
  Bottom 0.254: v32.31,21.59 32.21,21.59 32,21.8 | 44.86,30.83 44.86,30.68 44.96,30.58 | v47.14,30.94 47.14,31.4 | v14.69,34.72 14.69,34.09 | v8.79,32.51 8.97,32.82 | v7.7,36.63 7.07,35.99 | v12.2,38.05 12.8,38.05 13.11,38.35
  Bottom 0.305: 14.72,29.38 14.77,29.38 | v59.79,13.15 60.02,13.53 | v14.17,26.43 14.17,26.28 13.87,25.98
  Bottom 0.406: v45.11,30.79 45.11,30.58 45.11,30.69 | v64.36,46.23 64.36,46.08 64.67,45.77 | v54.81,41.41 54.2,40.9 54.15,40.95 | v27.94,15.51 26.67,16.78 | v8.84,22.06 8.74,22.06 8.64,21.96
  Bottom 0.61: U100.P$21 v7.62,41.82 | U100.P$22 8.89,42.64 v8.84,41.82 | U100.P$24 11.43,42.43 | U100.P$26 13.97,42.64 v13.87,41.82 | U100.P$27 15.24,42.43
  Bottom 0.813: v12.5,20.64 11.43,21.1 11.43,21.55
  other vias: 73.76,30.39 73.76,33.44 73.76,31.92 73.46,42.28 16.51,9.6 18.57,10.05 64.99,4.29 65.07,11.95 65.14,19.32 66.16,19.32 65.07,10.89 74.37,41.67 19.64,10.05 71.63,25.82 72.24,24.91 73.46,43.81 73.46,45.33 73.46,46.85 2.29,49.29 2.29,47.77 2.29,46.24 2.29,44.72 2.59,43.65 3.51,43.04 4.57,42.59 5.79,42.28 18.14,49.29 18.14,47.77 18.14,46.24 18.14,44.72 17.83,43.27 16.84,42.05 11.43,41.82 15.24,41.82
  pour Bottom (isolate 0.254, rank 2): -1.37,50.13 81.42,49.45 80.82,-2.81 -1.41,-2.41
  pour Top (no thermals): 10.32,8.8 11.27,8.8 12.23,9.75 18.29,9.82 18.29,10.82 20.16,10.97 20.16,8.17 15.08,8.17 14.13,8.48 11.91,8.48 10.96,7.85 10.32,7.85
  pour Top (isolate 0.254, no thermals): 64.77,19.57 67.51,19.57 67.36,3.27 64.62,3.27
  pour Top: 78.33,23.99 72.54,23.99 71.02,24.6 71.02,26.13 71.32,28.57 72.54,28.57 72.54,47.77 80.77,47.77 80.77,43.2 78.03,41.67
  pour Top (isolate 0.61): 0.18,49.83 20.88,49.67 20.8,41.95 0.08,41.95 0.15,49.8 0.18,49.8
IND
  pour Top (no thermals): 12.7,7.85 12.7,3.09 11.43,3.09 11.43,6.58 12.07,7.85
LED0
  Top 0.254: U2.100 29.48,32.45 27.97,32.45 24.08,36.34 24.08,37.7 23.76,38.02 LED2.A
LED1
  Top 0.254: 23.08,36.4 LED1.A 23.08,36.27 33.38,25.98 33.65,25.98 U2.1
LORA_RST_N  (via drill 0.3)
  Top 0.254: LORA_RST_N.1 22.55,38.93 20.88,38.93 20.42,39.39 v20.27,39.39
  Top 0.305: v20.27,39.39 20.12,39.54 R12.1
  Bottom 0.305: 20.32,39.34 v20.27,39.39 20.27,36.59 U100.P$32
M1IN1
  Top 0.254: U2.52 56.87,27.58 U11.10
M1IN2
  Top 0.254: U2.53 56.66,28.08 U11.9
M2IN1
  Top 0.254: U2.54 56.45,28.59 U11.8
M2IN2
  Top 0.254: U2.55 56.21,29.07 U11.7
M3IN1
  Top 0.254: U2.56 56.09,29.63 64.41,29.63 67.46,32.68 72.49,37.71 72.54,37.76 U12.10
M3IN2
  Top 0.254: U12.9 72.29,38.27 64.16,30.14 55.87,30.14 U2.57
M4IN1
  Top 0.254: U12.8 72.04,38.78 63.96,30.7 55.71,30.7 U2.58
M4IN2
  Top 0.254: 73.28,39.29 U12.7 71.81,39.26 71.71,39.26 63.75,31.31 63.65,31.21 55.54,31.21 U2.59
M5IN1
  Top 0.203: U2.29 50.21,13.83 50.34,13.83 57.81,6.37 U4.10
M5IN2
  Top 0.203: U4.9 57.91,6.87 50.65,14.14 U2.30
M5OUT1
  Top 0.305: U4.2 67.82,5.86 67.97,5.71 | 67.97,2.66 67.97,2.2 67.97,2.15 72.14,2.15 RS1.I1
  pour Top (no thermals): 67.82,5.86 68.12,5.86 68.12,2.35 72.69,2.35 72.69,2.05 67.82,2.05
M6IN1
  Top 0.203: U2.32 50.34,15.93 50.34,15.71 50.49,15.56 51.51,14.54 57.25,8.8 57.89,8.17 62.46,8.17 63.25,7.38 U4.8
M6IN2  (via drill 0.3)
  Top 0.203: U2.31 52.12,13.33 57.76,7.69 62.08,7.69 62.18,7.59
  Top 0.254: 62.18,7.59 v62.08,7.53 | v63.45,8.2 63.78,7.87 U4.7
  Bottom 0.254: v63.45,8.2 62.79,7.53 v62.08,7.53
M7IN1
  Top 0.203: U2.36 51.87,17.14 51.97,17.14 52.43,16.68 52.43,15.76 52.43,15.61 54.41,13.63 55.12,12.92 55.52,12.92 57.25,11.19 61.8,11.19 63.78,13.17 63.78,16.37 64.39,16.98 65.08,16.98 | 65.08,16.98 U5.10 65.08,16.98
M7IN2
  Top 0.203: U2.37 51.01,18.71 52.88,16.83 52.88,15.76 54.71,13.94 55.32,13.33 55.73,13.33 57.45,11.6 61.59,11.6 63.32,13.33 63.32,16.6 64.24,17.52 65.1,17.52 U5.9
M8IN1
  Top 0.203: U2.38 51.34,18.98 52.27,18.05 53.19,17.14 53.34,16.98 53.34,16.83 53.34,15.92 55.02,14.24 55.52,13.73 55.93,13.73 57.66,12.01 61.32,12.01 62.87,13.55 62.87,16.83 64.01,17.97 64.08,18.05 U5.8
M8IN2  (via drill 0.3)
  Top 0.203: v57.76,12.79 58.14,12.41 58.29,12.41 61.04,12.41 62.41,13.78 62.41,16.98 63.86,18.43 63.93,18.51 65.1,18.51 U5.7
  Top 0.254: U2.39 52.62,18.51 v52.73,18.51
  Bottom 0.254: v52.73,18.51 53.49,17.75 53.49,16.53 53.49,15.62 55.02,14.09 56.08,14.54 v57.76,12.79
M1234SLEEP  (via drill 0.3)
  Top 0.254: U2.51 56.56,26.59 70.1,26.59 | 70.1,26.59 v70.71,26.59 | v70.71,26.59 71.88,26.59 | 71.88,26.59 U11.12 | U11.11 73.25,27.09 72.19,27.09 71.88,26.79 71.88,26.59 | U12.11 72.7,37.25 72.24,36.8 | 72.24,36.8 71.93,36.49 71.93,34.36 72.24,34.05 v72.24,30.09 | U12.12 72.26,36.77 72.24,36.8 | v70.71,26.59 70.1,26.59
  Bottom 0.254: v72.24,30.09 72.24,28.11 v70.71,26.59
M5678SLEEP  (via drill 0.3)
  Top 0.203: U2.33 50.75,16.14 50.75,15.92 53.49,13.17 55.98,10.68 56.24,10.68 v56.44,10.68 61.92,10.68 64.21,12.97 64.21,15.82 64.44,16.04 U5.12
  Top 0.254: U4.11 U4.12 64.64,5.38 64.21,5.81 57.86,5.81 56.95,5.81 56.44,6.32 v56.44,6.77 | U5.11 U5.12 | v56.44,10.68 56.24,10.68
  Bottom 0.254: v56.44,6.77 v56.44,10.68
N$1
  Top 0.254: U2.12 38.88,18.11 38.33,18.11 37.73,17.5 L2.1 36.81,18.25 C15.+
  Top 0.305: 37.73,17.5 L2.1 | C15.+ 35.05,17.79 C14.2
N$2  (via drill 0.3)
  Top 0.305: 15.73,4.79 15.84,4.68 R7.1 15.61,4.53 v15.04,5.1 | U1.5 14.73,7.1 v14.73,7.08
  Bottom 0.254: v14.73,7.08 v15.04,5.1
N$4
  Top 0.406: R8.2 3V.C
N$5
  Top 0.305: R11.2 LED2.C
N$6
  Top 0.305: R10.2 18.91,36.57 LED1.C
N$7
  cutout Bottom: 53.72,16.14 53.95,17.99 52.94,19.06 51.66,20.33 51.66,20.96 52.3,21.6 52.94,21.6 55.02,19.51 56.69,19.43 58.28,17.84 58.08,16.86 60.24,14.29 58.65,12.71 56.38,15.18 55.11,14.46
N$8
  Top 0.254: U2.41 53.91,18.61 Q2.P2 53.91,16.49 C18.2
N$10
  Top 0.254: U2.42 54.21,19.03 Q2.P1 | 54.85,19.03 56.45,19.03 C19.2
  Top 0.305: 54.85,19.03 Q2.P1
N$13
  Top 0.254: U12.2 76.07,37.25 76.07,36.87 arc23 76.68,33.88
  Top 0.406: 76.68,33.88 76.81,32.88 M3/M4.1
N$14  (via drill 0.3)
  Top 0.305: R6.1 19.62,4.52 v20.42,3.72
  Bottom 0.305: v20.42,3.72 20.42,3.75 LED5_J.2
N$15
  Top 0.305: U7.5 74.37,5.4 74.98,4.79 RS1.V2
N$16
  Top 0.305: 76.09,37.23 76.2,35.68 | 76.2,35.68 76.45,34.43 78.2,32.88 | 76.2,35.68 76.75,33.06 76.45,34.38 77.52,33.11 76.86,33.98 77.67,33.16
N$17
  Top 0.305: U7.4 73.54,4.75 RS1.V1
N$18
  Top 0.254: C2.2 10.43,32.56 IC1.9
N$19
  Top 0.254: IC1.27 9.93,38.63 Q1.2 7.92,39.17 C5.1
N$21
  Top 0.406: RS1.I2 76.76,2.05 M5/M6.1
N$23
  Top 0.305: U8.4 73.74,10.18 73.36,10.18 72.24,9.06 RS2.V1
N$24
  Top 0.305: U8.5 74.37,10.89 74.99,10.27 RS2.V2
N$25
  Top 0.305: 71.93,7.53 RS2.I1 70.26,7.53 70.1,7.53 69.44,6.87 U4.4
N$26  (via drill 0.3)
  Top 0.305: v20.93,12.2 21.42,12.16 22.11,12.16 R8.1
  Bottom 0.305: LED33_J.2 21.31,12.97 v20.93,12.2
N$27
  Top 0.406: RS2.I2 77.17,7.53 M5/M6.3
N$28
  Top 0.305: U9.5 74.68,16.37 74.99,16.06 RS3.V2
N$29
  Top 0.305: RS3.V1 73.54,15.72 U9.4
N$30
  Top 0.305: U10.5 74.52,21.86 74.83,21.55 74.83,20.07 RS4.V2
N$31
  Top 0.305: U10.4 73.11,21.21 72.85,20.95 72.39,20.49 72.39,20.06 RS4.V1
N$32
  Top 0.406: 75.02,12.99 77.5,12.99 M7/M8.1
  Top 0.61: RS3.I2 75.02,12.99
N$33
  Top 0.254: U2.44 54.98,19.66 56.88,19.66 57.31,20.09 R14.1
N$34
  Top 0.254: U2.14 39.6,17.39 39.6,16.84
  Top 0.305: 39.6,16.84 38.99,16.23 L2.2
N$35
  Top 0.305: RS4.I1 70.1,18.51 69.49,17.9 69.14,17.54 U5.4
N$36
  Top 0.305: RS3.I1 68.58,13.02 67.97,13.63 67.97,15.76 67.97,16.37 67.82,16.53 U5.2
N$37
  Top 0.406: RS4.I2 77.06,18.51 M7/M8.3
N$38  (via drill 0.3)
  Top 0.305: U4.3 68.33,6.37 68.53,6.16 68.53,4.89 v68.68,4.79
  Bottom 0.305: v68.68,4.79 71.78,4.79
  Bottom 0.406: v68.68,4.79 71.78,4.79 76.2,4.79 76.96,4.79 M5/M6.2
N$39
  Top 0.305: U12.3 76.22,37.76 76.53,37.61 77.27,36.2 | 77.27,36.2 77.39,35.98 | M3/M4.2 77.52,35.96 77.19,35.8 76.81,36.2 77.27,36.2
N$40
  Top 0.305: 78.25,38.32 77.42,38.31 U12.4
  Top 0.406: M3/M4.3 77.42,38.31
N$41
  Top 0.305: 77.14,40.76 76.02,38.88 75.92,38.78 U12.5
  Top 0.406: 77.14,40.76 M3/M4.4
N$42
  Top 0.254: U1.6 15.5,10.58 C10.1
N$43  (via drill 0.3)
  Top 0.305: U4.5 69.04,7.38 69.19,7.53 69.95,8.3 v70.71,8.3
  Bottom 0.406: 71.17,8.45 75.29,8.45 76.81,9.67 77.45,10.28 77.45,10.36 M5/M6.4 | 71.17,8.45 71.02,8.45 71.17,8.45 | 71.17,8.45 v70.71,8.3
N$44
  Top 0.305: R6.2 5V.C
N$45  (via drill 0.3)
  Top 0.305: v70.71,19.27 69.95,19.27 68.89,18.2 68.73,18.05 U5.5
  Bottom 0.406: v70.71,19.27 72.05,20.61 77.5,20.61 M7/M8.4
N$49
  Top 0.305: U11.2 76.02,27.07 76.07,25.88 76.4,24.71
  Top 0.61: 76.66,24.22 arc-1 76.4,24.71
  Top 0.813: M1/M2.1 76.66,24.22
N$50
  Top 0.305: U11.3 76.17,27.58 76.37,27.48 76.58,27.12 | 76.58,27.12 77.54,25.8 77.14,25.8 | 77.14,25.8 76.81,25.8 76.73,25.8 76.58,27.12 | 76.58,27.12 77.14,25.8
  Top 0.406: M1/M2.2 76.81,25.8
N$51
  Top 0.305: U11.4 75.92,28.08 | 75.92,28.08 77.14,28.08 77.14,27.83 76.53,28.03 | 76.53,28.03 76.32,28.24 | 76.32,28.24 75.92,28.08 | 75.92,28.08 77.14,28.64 77.14,28.24 76.32,28.24 | 75.92,28.08 76.53,28.03
  Top 0.406: 77.14,28.24 M1/M2.3
N$52
  Top 0.305: U11.5 75.81,28.59 76.93,30.07 75.92,28.69 76.7,30.22 76.58,29.76
  Top 0.406: 76.93,30.07 77.34,30.07 77.42,30.14 76.81,30.14 76.81,30.45 M1/M2.4
N$54  (via drill 0.3)
  Top 0.305: U5.3 68.53,17.03 69.19,16.37 v69.19,15.76
  Bottom 0.406: v69.19,15.76 77.27,15.76 M7/M8.2
N$59
  Top 0.305: 75.41,37.76 76.27,37.76 76.47,37.66 76.68,37.3 | 76.68,37.3 77.64,35.98 77.24,35.98 | 77.24,35.98 76.91,35.91 76.68,37.3 | 76.68,37.3 77.24,35.98 | 77.24,35.98 78.18,35.81
N$60
  Top 0.305: 75.41,38.27 76.02,38.27 | 76.02,38.27 77.24,38.27 77.24,38.02 76.63,38.22 | 76.63,38.22 76.42,38.42 | 76.42,38.42 76.02,38.27 | 76.02,38.27 77.24,38.83 77.24,38.42 76.42,38.42 | 76.02,38.27 76.63,38.22 | 76.63,38.22 78.18,38.35
N$61
  Top 0.305: 75.41,38.78 75.92,38.78 77.03,40.25 76.02,38.88 76.83,40.86 76.68,39.95 78.18,40.89
N$73
  Top 0.254: IC1.26 10.43,38.51 Q1.1 12.56,39.17 C6.1
N$76  (via drill 0.3)
  Top 0.254: U2.94 39.62,26.54 39.62,25.55 v39.12,25.05 | v30.28,25.25 25.91,25.25 25.74,25.25 PROG.6
  Bottom 0.254: v39.12,25.05 31.7,25.05 31.6,25.15 30.38,25.15 v30.28,25.25
N$77  (via drill 0.3)
  Top 0.254: U2.95 38.91,26.54 38.91,25.96 38.2,25.25 38.2,24.74 v38,24.39 | v30.89,24.44 23.77,24.44 23.72,24.44 PROG.5
  Bottom 0.254: v38,24.39 37.8,24.44 v30.89,24.44
P1.0  (via drill 0.3)
  Top 0.254: U2.4 36.32,21.19 35.97,21.19 33.33,23.83 28.09,29.26 v26.67,30.69 | v28.04,36.58 28.09,38.66 27.28,39.42 24.13,42.57 24.13,44.71 24.69,45.22 DIGITAL_IO1.19
  Bottom 0.254: v28.04,36.58 28.04,32.06 v26.67,30.69
P2.1
  Top 0.254: U2.17 42.99,18.66 43.38,18.66 45.92,16.12 45.92,15.1 42.37,11.55 DIGITAL_IO2.8
P2.4
  Top 0.254: U2.20 34.8,8.35 34.8,6.16
  Top 0.813: 34.8,6.16 34.8,6.32 DIGITAL_IO2.2
P2.5
  Top 0.254: U2.21 36.02,8.88 36.02,5.25 34.75,3.98 DIGITAL_IO2.1
P2.6
  Top 0.254: U2.22 37.29,9.43 DIGITAL_IO2.4
P2.7
  Top 0.254: U2.23 38.56,9.99 38.56,5.15 37.29,3.88 DIGITAL_IO2.3
P5.6  (via drill 0.3)
  Top 0.254: U2.70 51.87,35.33 51.87,36.64 50.6,37.91 v50.6,37.96 | v48.06,40.5 46.58,39.03 46.58,38.57 45.82,37.81 45.26,37.81 43.18,39.89 DIGITAL_IO1.6
  Bottom 0.254: v50.6,37.96 v48.06,40.5
P5.7  (via drill 0.3)
  Top 0.254: DIGITAL_IO1.5 42.06,44.76 42.06,38.73 43.38,37.41 v43.38,36.39 | v45.72,30.09 45.82,30.19 47.24,30.19 47.65,30.19 48.06,30.6 48.06,31 47.65,31.41 47.65,31.82 47.75,31.92 47.85,32.02 48.5,32.66 U2.71
  Bottom 0.254: v43.38,36.39 43.59,36.19 43.59,35.07 43.59,34.97 45.72,32.83 45.92,32.63 45.92,30.6 45.72,30.39 v45.72,30.09
P6.6
  Top 0.254: U2.80 42.32,33.73 42.32,36.27 40.64,37.95 40.64,41.51 DIGITAL_IO1.8
P6.7
  Top 0.254: U2.81 41.76,33.6 41.76,34.95 39.37,37.34 39.37,44.6 DIGITAL_IO1.7
P7.0
  Top 0.203: U2.88 39.87,30.53 39.17,30.53 38.56,30.53 36.83,32.26 35.56,33.53 35.56,41.86 DIGITAL_IO1.12
P7.1
  Top 0.203: U2.89 39.51,30.18 38.51,30.18 38.2,30.18 37.9,30.48 34.29,34.09 34.29,44.76 35.41,45.88 DIGITAL_IO1.11
P7.2
  Top 0.203: U2.90 39.18,29.82 38.2,29.82 37.85,29.82 37.49,30.18 33.02,34.65 DIGITAL_IO1.14
P7.3
  Top 0.203: U2.91 38.82,29.47 37.8,29.47 37.49,29.47 37.13,29.82 31.75,35.21 31.75,44.4 33.02,45.67 DIGITAL_IO1.13
P7.4
  Top 0.254: DIGITAL_IO2.7 42.37,4.13 43.64,5.4 43.64,7.43 43.64,11.95 46.74,15.05 46.88,15.05 U2.26
P7.5
  Top 0.254: U2.27 48.16,14.45 48.16,14.19 47.7,13.73 47.65,13.68 46.33,13.68 44.91,12.26 44.91,7.18 DIGITAL_IO2.10
P7.6
  Top 0.254: U2.28 48.72,14.61 48.72,13.88 47.95,13.12 46.58,13.12 46.18,12.72 46.18,5.86 46.18,5.2 44.91,3.93 DIGITAL_IO2.9
P9.2  (via drill 0.3)
  Top 0.254: 48.62,35.77 v48.51,35.87 48.51,34.81 U2.74 | v46.02,39.52 45.97,39.83 45.97,43.34 DIGITAL_IO1.4
  Bottom 0.254: 46.13,39.42 v46.02,39.52 48.51,37.04 48.51,36.88 v48.51,35.87
P9.3  (via drill 0.3)
  Top 0.254: U2.75 47.6,34.58 v47.65,35.11 | v45.67,38.71 44.45,39.93 44.45,44.55 45.72,45.82 DIGITAL_IO1.3
  Bottom 0.254: v47.65,35.11 arc-90 47.7,35.21 47.7,36.68 v45.67,38.71
P9.4
  Top 0.203: 29.87,37.04 29.87,40.54 28.35,42.06 27.94,42.47 DIGITAL_IO1.18
  Top 0.254: U2.96 29.87,34.9 29.87,37.04
P9.5
  Top 0.203: 29.36,36.33 29.36,39.98 26.72,42.62 26.72,44.66 DIGITAL_IO1.17
  Top 0.254: U2.97 29.36,34.69 29.36,36.33
P10.2  (via drill 0.3)
  Top 0.254: U2.2 37.39,23.69 37.39,24.03 36.98,24.44 36.37,24.44 29.26,31.55 v29.16,31.55 | v28.7,35.82 28.7,37.65 28.7,39.37 25.86,42.22 25.86,42.88 DIGITAL_IO1.20
  Bottom 0.254: v29.16,31.55 29.06,31.65 28.7,32.01 v28.7,35.82
P10.4
  Top 0.254: U2.24 39.83,10.54 DIGITAL_IO2.6
P10.5
  Top 0.254: U2.25 41.1,11.12 41.1,5.2 39.83,3.93 DIGITAL_IO2.5
PJ.2
  Top 0.203: U2.85 40.95,31.58 40.95,32.06 41.25,32.36 41.25,34.19
  Top 0.254: 38.2,41.81 38.2,42.83 | 38.2,42.83 38.2,43.34 DIGITAL_IO1.10 | 41.25,34.19 41.25,34.55 39.52,36.27 38.2,37.59 38.2,42.83
PJ.3
  Top 0.203: 40.74,34.09 40.74,32.46 40.54,32.26 40.54,31.24 40.62,31.17 40.64,31.17 U2.86
  Top 0.254: DIGITAL_IO1.9 36.83,44.6 36.83,44.05 36.83,38.26 36.83,38 39.52,35.31 40.64,34.19 40.74,34.09
PJ.4
  Top 0.203: U2.92 38.46,29.11 37.29,29.11 37.19,29.11 36.78,29.52 31.09,35.21 31.09,41.91 30.48,42.52 DIGITAL_IO1.16
PJ.5
  Top 0.203: U2.93 38.13,28.76 37.03,28.76 36.88,28.76 30.48,35.11 30.48,36.22 | 30.48,37.54 30.48,41.41 29.21,42.67 29.21,44.6 DIGITAL_IO1.15
  Top 0.254: 30.48,35.31 30.48,36.22 30.48,37.54
RFGND
  cutout Bottom (isolate 0.813): 7.29,49.77 12.93,49.72 12.95,43.91 7.32,43.96
RST_N  (via drill 0.3)
  Top 0.254: U2.83 44.31,29.62 44.86,29.62 v45.52,28.96 | v31.7,23.62 21.95,23.62 21.7,23.62 PROG.4 | v42.93,26.37 41.66,26.37 41.39,26.37 39.93,24.91 38.75,23.73 v38.56,23.73
  Top 0.305: PROG.4 17.49,28.5 | 17.49,28.5 16.39,28.5 C11.2 | 17.49,28.5 17.49,29.6 R9.2
  Bottom 0.254: v31.7,23.62 31.8,23.73 v38.56,23.73 | v45.52,28.96 v42.93,26.37
RX0
  Top 0.254: U2.6 36.45,19.92 35.81,19.92 32.92,22.81 arc16 32.77,22.93 | 31.24,22.93 31.55,22.93 | 31.55,22.93 32.77,22.93 | 32.77,22.93 32.8,22.93 | 31.55,22.93 21.49,22.93 19.88,22.93 PROG.3
RX1
  Top 0.254: RX1/TX1.3 27.13,5.4 27.64,5.91 30.11,5.91 30.92,5.91 U2.18
RX2  (via drill 0.3)
  Top 0.254: U2.34 49.93,17.65 50.9,16.68 51.16,16.42 51.21,16.12 51.21,16.07 51.56,15.76 51.66,15.76 51.82,15.61 53.95,13.48 55.02,12.41 v55.27,12.31 | RX2/TX2.3 52.98,4.23 v52.98,9.31
  Bottom 0.254: v55.27,12.31 55.27,12.21 55.27,11.65 53.24,9.62 v52.98,9.31
RX3  (via drill 0.3)
  Top 0.254: U2.98 27.26,36.07 27.14,36.19 v26.52,36.19 | v23.32,32.98 22.71,32.98 17.68,32.98 11.73,27.04 v7.92,27.04
  Bottom 0.254: v26.52,36.19 23.62,33.29 v23.32,32.98 | v7.92,27.04 6.86,27.04 6.63,27.04 6.4,27.04 3.35,23.99 3.2,23.84 U100.P$6
SCL  (via drill 0.3)
  Top 0.254: U2.11 41.07,20.98 v41.53,20.98 42.49,20.98 42.64,20.98 44.2,19.42 46.43,17.19 46.43,17.03 v46.43,16.58 | R2.1 4.81,28.32 3.96,29.18 3.96,31.31 3.96,32.22 v4.57,32.83 | v47.04,12.41 47.53,11.92 IC2.4
  Top 0.305: v30.68,17.8 28.96,17.8 27.94,16.78 8.89,16.78 4.67,16.78 JP2.7 JP2.5 3.86,20.64 4.22,21 | R2.1 4.81,28.09 | 5.08,28.26 R2.1 | IC1.19 10.59,36.11 v9.86,35.37 | 4.81,27.87 R2.1 | 3.81,20.59 4.22,21 | 4.22,21 5.49,22.27 5.49,26.43 5.49,27.59 arc90 R2.1
  Bottom 0.254: v46.43,16.58 46.63,16.17 46.63,13.63 46.63,13.33 v47.04,12.41 | 38.9,18.24 38.86,18.2
  Bottom 0.305: v41.53,20.98 38.99,18.33 38.9,18.24 | 38.86,18.2 38.45,17.8 v30.68,17.8 | v9.86,35.37 7.11,35.37 v4.57,32.83
SDA  (via drill 0.3)
  Top 0.203: 41.02,21.65 v41.02,21.69 41.02,21.65
  Top 0.254: U2.10 41.02,21.65 | IC1.20 13.7,37.02 v14.43,36.29 | IC2.3 47.47,10.4 47.75,10.68 48.21,12.31 v48.11,12.41 | v41.02,21.69 41.04,21.71 42.67,21.71 46.69,17.69 v46.84,17.69
  Top 0.305: v31.52,18.64 30.41,18.64 28.48,18.64 27.43,17.59 8.94,17.59 JP2.8 | 6.99,20.59 6.99,20.97 | 7.84,17.98 7.87,18.01 7.96,18.1 JP2.8 | v4.88,31.92 4.81,31.85 R3.1 5.94,28.96 6.1,28.81 arc-31 6.25,28.26 6.25,21.33 6.99,20.59 | JP2.8 JP2.6 7.04,20.64 6.99,20.59
  Bottom 0.254: 14.43,36.13 v14.43,36.29 12.14,36.29 10.52,34.66 7.62,34.66 7.32,34.36 v4.88,31.92 | v46.84,17.69 47.24,17.29 47.24,13.83 47.24,13.33 47.65,12.92 v48.11,12.41
  Bottom 0.305: v41.02,21.69 40.82,21.19 40.62,20.96 38.81,19.15 38.51,18.85 38.3,18.64 v31.52,18.64 | 14.38,36.34 v14.43,36.29
SPI_EXTSLAVE_TE  (via drill 0.3)
  Top 0.254: U2.76 44.8,34.24 50.14,39.58 v52.32,41.76
  Bottom 0.254: v52.32,41.76 SPI.1
SPI_FLASH_CS
  Top 0.254: R18.1 69.21,43 68.58,42.37 67.31,42.37 66.69,42.37 U6.CE 66.45,42.44 65.38,41.37 57.25,41.37 55.58,40 55.58,38.32 U2.69
SPI_MISO  (via drill 0.3)
  Top 0.254: SPI.2 49.53,44.6 49.53,42.47 49.53,40.8 44.5,35.77 43.74,35.77 42.98,35 42.98,33.78 U2.79 | U6.SO 64.14,43.71 v63.25,44.6
  Bottom 0.254: SPI.2 52.07,44.6 55.17,44.6 62.64,44.6 | 62.64,44.6 v63.25,44.6 | v63.25,44.6 63.4,44.6 | v63.25,44.6 62.64,44.6
SPI_MOSI
  Top 0.254: U2.78 43.43,34.05 43.43,34.55 44.04,35.16 44.81,35.16 52.12,42.47 52.12,44.76 53.24,45.88 SPI.4 58.15,45.88 U6.SI
SPI_SCK
  Top 0.254: U2.77 45.18,33.02 45.26,33.02 45.41,33.02 45.87,33.48 45.87,34.39 53.34,41.86 SPI.3 54.99,44.98 U6.SCK
TX0
  Top 0.254: U2.7 36.72,19.46 35.56,19.46 32.72,22.3 32,22.3 25.74,22.3 25.45,22.01 20.49,22.01 17.96,22.01 PROG.2
TX1
  Top 0.254: U2.19 29.67,3.93 RX1/TX1.2
TX2  (via drill 0.3)
  Top 0.254: 51.82,16.53 v51.82,16.42 51.82,16.47 U2.35 | v50.29,13.02 53.14,10.18 55.07,8.25 RX2/TX2.2
  Bottom 0.254: v51.82,16.42 51.82,14.54 v50.29,13.02 | v50.29,13.02 50.24,12.97 v50.29,13.02
TX3  (via drill 0.3)
  Top 0.254: U2.99 29.32,33.29 28.35,33.29 v25.3,36.19 | v22.55,33.75 17.37,33.75 11.43,27.8 v7.01,27.8
  Bottom 0.254: v7.01,27.8 6.4,27.8 3.71,25.11 U100.P$7
  Bottom 0.305: v22.55,33.75 22.86,33.75 v25.3,36.19
V_MOTOR  (via drill 0.3)
  Top 0.305: C34.2 75.31,35.23 U12.1 | C33.2 75.31,25.28 U11.1
  Top 0.406: v75.29,32.53 75.29,34.67 C34.2
  Top 0.61: v75.29,32.53 v75.29,32.54 | v75.59,23.99 75.15,24.44 C33.2
  Bottom 0.61: VMOT_SEL.2 76.38,41.85 75.29,40.76 v75.29,32.53 75.29,24.3 v75.59,23.99
V_MOTOR2  (via drill 0.6)
  Top 0.305: U5.1 67.21,15.99 67.21,15.61 67.21,15.15 67.06,15 66.9,15 | U4.1 67.16,5.15 67.21,5.1 67.21,4.25 C23.2
  Top 0.61: C26.2 66.9,14.85 66.9,15 | C26.2 66.99,14.63 | v66.29,9.97 66.14,10.12 66.14,13.48 66.45,13.78 66.99,14.33 C26.2 | v66.9,2.96 66.9,3.94 C23.2
  Bottom 0.61: v66.29,9.97 66.29,3.27 | 66.29,3.27 v66.9,2.96 66.44,2.96 | VMOT_SEL100.2 65.38,2.35 | 65.38,2.35 66.29,3.27 | V_MOT1.2 63.86,2.61 64.77,2.61 65.02,2.35 65.38,2.35
V_MOTOR_ALT
  Bottom 1.016: VMOT_SEL.3 74.86,45.8 V_MOT2.2
VREF_M  (via drill 0.3)
  Top 0.254: U7.1 71.83,6.05 | U9.1 72.47,17.59 74.37,17.59 74.57,17.59 75.39,16.78
  Top 0.305: v72.85,22.47 72.81,22.51 U10.1 | 74.98,6.57 74.93,6.62 72.44,6.62 72.24,6.39 U7.1 | U8.1 72.47,12.11 74.07,12.11 74.68,12.11 arc-90 74.73,12.06
  Top 0.406: U3.2 69.93,1.05 70.41,0.57 77.78,0.57 79.2,2 79.2,6.67 | 79.2,6.67 79.2,11.7 | 79.2,11.7 79.2,16.73 | 79.2,16.73 79.2,21.2 78.54,21.86 76.66,21.86 76.35,21.55 v75.64,21.55 | 75.39,16.78 79.15,16.78 79.2,16.73 | 74.98,6.57 79.1,6.57 79.2,6.67 | 74.73,12.06 76.25,12.06 76.66,11.65 79.15,11.65 79.2,11.7
  Bottom 0.406: v75.64,21.55 73.76,21.55 v72.85,22.47

## Text on the board
tNames: GND | Octanis 1 v0.6 | AGND A1 | A8 A9 | GND 3V3 | TE MISO | CLK MOSI | 3V3 | octanis.org | GND | GND | GND | 3V3 | GND | 3V3 | 5V | GND | 5V|GND|_3V3|__GND_|
bNames: 3V3 V_mot V_ext | 3V3 V_mot 5V
tValues: HMC5883L